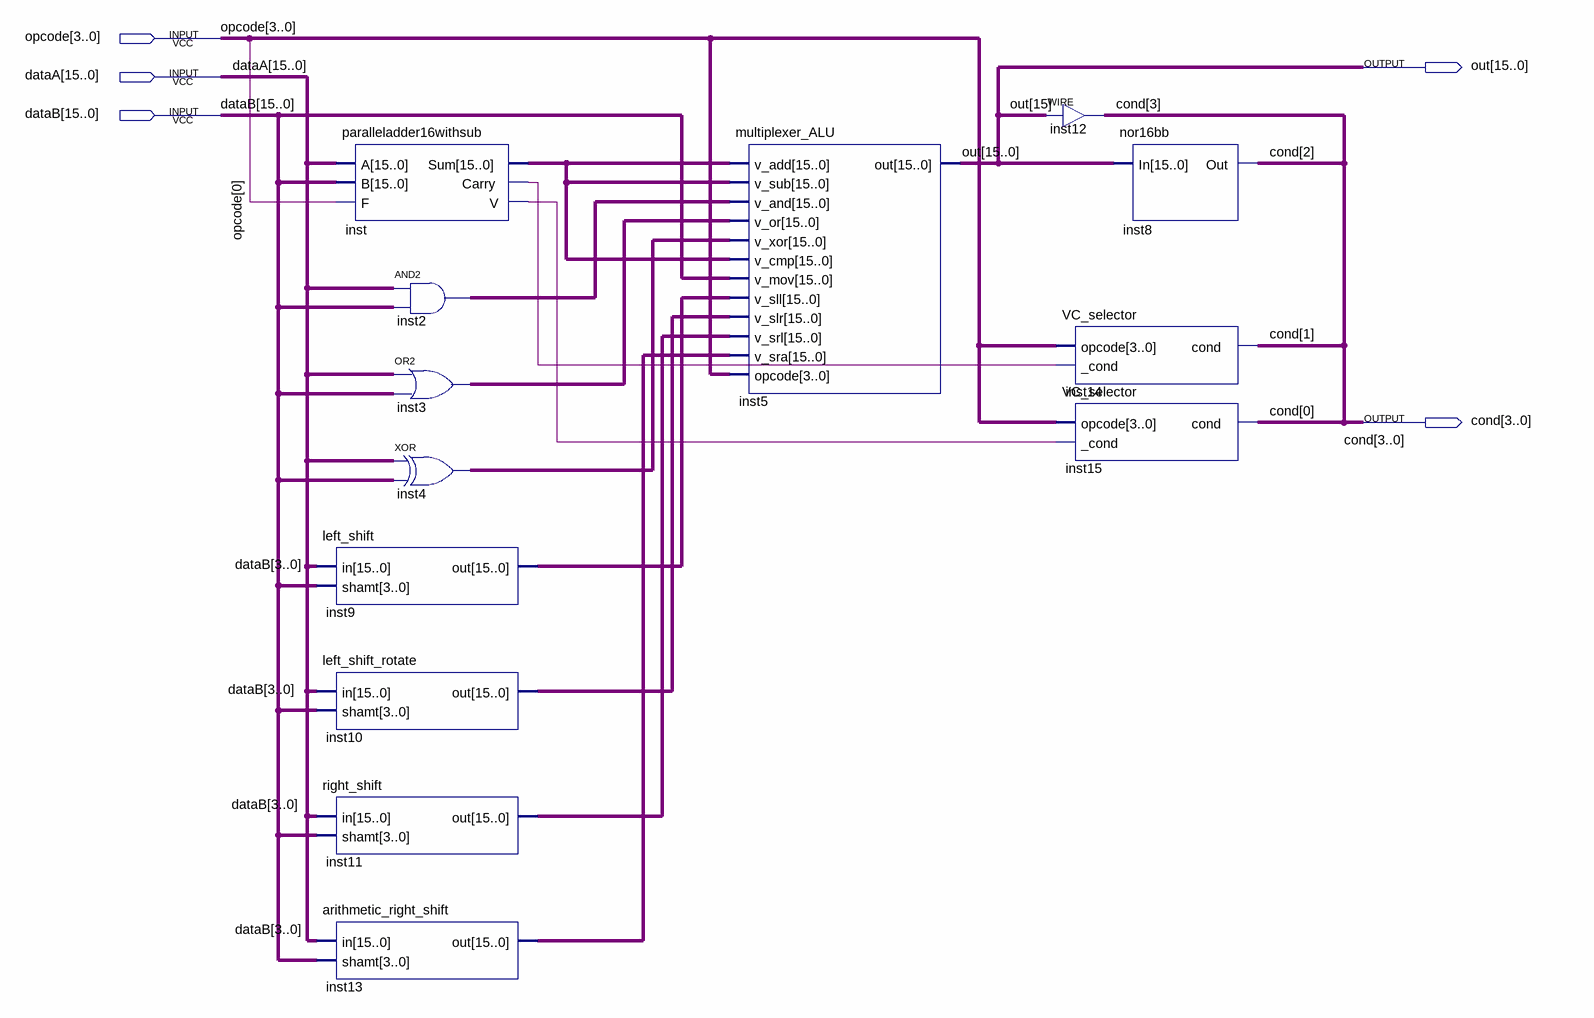
[diagram p0: schematic sheet]
// Quartus schematic ALU.bdf as structural Verilog: 13 symbols, 5 pins
module ALU (
  input  [3:0] opcode,
  input  [15:0] dataA,
  input  [15:0] dataB,
  output [15:0] out,
  output [3:0] cond
);

  wire inst_carry, inst_v;
  wire [15:0] inst2_out, inst3_out, inst4_out, inst9_out, inst10_out, inst11_out, inst13_out, inst_sum;

  paralleladder16withsub inst (.A(dataA), .B(dataB), .F(opcode[0]), .Sum(inst_sum), .Carry(inst_carry), .V(inst_v));
  left_shift inst9 (.in(dataA), .shamt(dataB[3:0]), .out(inst9_out));
  left_shift_rotate inst10 (.in(dataA), .shamt(dataB[3:0]), .out(inst10_out));
  right_shift inst11 (.in(dataA), .shamt(dataB[3:0]), .out(inst11_out));
  arithmetic_right_shift inst13 (.in(dataA), .shamt(dataB[3:0]), .out(inst13_out));
  assign inst2_out = dataA & dataB;  // AND2 inst2, 16 bits wide
  assign inst3_out = dataA | dataB;  // OR2 inst3, 16 bits wide
  assign inst4_out = dataA ^ dataB;  // XOR inst4, 16 bits wide
  multiplexer_ALU inst5 (
    .v_add(inst_sum), .v_sub(inst_sum), .v_and(inst2_out), .v_or(inst3_out), .v_xor(inst4_out),
    .v_cmp(inst_sum), .v_mov(dataB), .v_sll(inst9_out), .v_slr(inst10_out), .v_srl(inst11_out),
    .v_sra(inst13_out), .opcode(opcode), .out(out));
  assign cond[3] = out[15];  // WIRE inst12
  nor16bb inst8 (.In(out), .Out(cond[2]));
  VC_selector inst14 (.opcode(opcode), ._cond(inst_carry), .cond(cond[1]));
  VC_selector inst15 (.opcode(opcode), ._cond(inst_v), .cond(cond[0]));
endmodule
